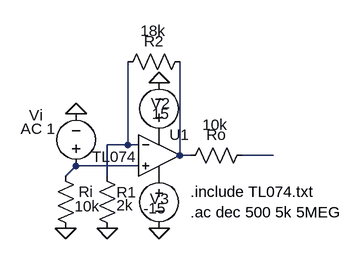
[diagram p0: schematic 4.2.1.circuit.asc]
4.2.1.circuit.asc, the LTspice schematic file:
Version 4
SHEET 1 880 680
WIRE 224 304 224 176
WIRE 224 304 192 304
WIRE 240 304 224 304
WIRE 304 320 304 176
WIRE 320 320 304 320
WIRE 448 320 400 320
WIRE 240 336 144 336
WIRE 128 352 144 336
WIRE 192 352 192 304
FLAG 128 432 0
FLAG 192 432 0
FLAG 144 256 0
FLAG 272 208 0
FLAG 272 432 0
SYMBOL Res 112 336 R0
WINDOW 3 30 62 Left 2
SYMATTR Value 10k
SYMATTR InstName Ri
SYMBOL Res 176 336 R0
WINDOW 3 30 61 Left 2
WINDOW 0 30 41 Left 2
SYMATTR Value 2k
SYMATTR InstName R1
SYMBOL Voltage 144 352 R180
WINDOW 0 51 94 Left 2
WINDOW 3 24 1 Left 2
WINDOW 123 32 73 Left 2
SYMATTR InstName Vi
SYMATTR Value ""
SYMATTR Value2 AC 1
SYMBOL opamp2 272 256 R0
WINDOW 3 -103 66 Left 2
SYMATTR Value TL074
SYMATTR InstName U1
SYMBOL Res 416 304 R90
WINDOW 0 0 56 VBottom 2
WINDOW 3 -47 58 VTop 2
SYMATTR InstName Ro
SYMATTR Value 10k
SYMBOL Res 320 160 R90
WINDOW 0 0 56 VBottom 2
WINDOW 3 -47 57 VTop 2
SYMATTR InstName R2
SYMATTR Value 18k
SYMBOL Voltage 272 304 R180
WINDOW 0 -17 64 Left 2
WINDOW 3 -16 48 Left 2
SYMATTR InstName V2
SYMATTR Value 15
SYMBOL Voltage 272 336 R0
WINDOW 0 -14 51 Left 2
WINDOW 3 -24 65 Left 2
SYMATTR InstName V3
SYMATTR Value -15
TEXT 320 376 Left 2 !.include TL074.txt\n.ac dec 500 5k 5MEG

The netlist it stands for:
* 4.2.1.circuit.asc
Ri N004 0 10k
R1 N001 0 2k
Vi N004 0 AC 1
XU1 N004 N001 P001 P002 N002 TL074  ; pins In+ In- V+ V- OUT
Ro N003 N002 10k
R2 N002 N001 18k
V2 P001 0 15
V3 P002 0 -15
.include TL074.txt
.ac dec 500 5k 5MEG
.backanno
.end